# EAGLE design ADS1015_shield (EAGLE 7.2.0)
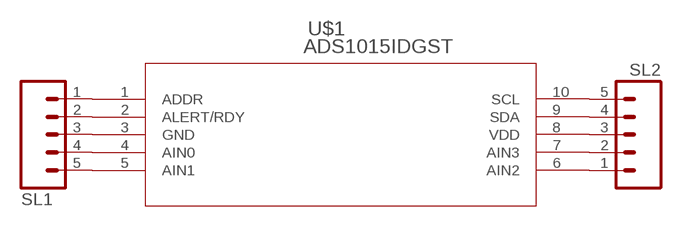
[diagram p0: schematic, sheet 1]

## Parts
SL1  M05  [05P]
SL2  M05  [05P]
U$1  ADS1015IDGST  [DGS10]

## Nets
N$1: SL1.1 U$1.1(ADDR)
N$2: SL1.2 U$1.2(ALERT/RDY)
N$3: SL1.3 U$1.3(GND)
N$4: SL1.4 U$1.4(AIN0)
N$5: SL1.5 U$1.5(AIN1)
N$6: SL2.1 U$1.6(AIN2)
N$7: SL2.2 U$1.7(AIN3)
N$8: SL2.3 U$1.8(VDD)
N$9: SL2.4 U$1.9(SDA)
N$10: SL2.5 U$1.10(SCL)

## Library data of the parts
SL1 SL2 = con-amp-quick:M05: AMP QUICK CONNECTOR; OC_FARNELL: unknown; OC_NEWARK: unknown
U$1 = ADS105IDGST:ADS1015IDGST; COPYRIGHT: Copyright C 2015 Accelerated Designs. All rights reserved; FAMILY: ADC; MANUFACTURER_NAME: Texas Instruments; MANUFACTURER_PART_NUMBER: ADS1015IDGST; RSPARTNUMBER: 7094550; SECTION: Data Converters; VENDOR: Texas Instruments

## Board
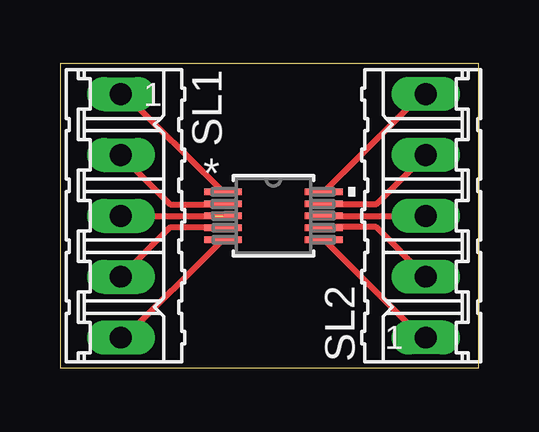
[diagram p1: board, top side]

Size 17.45 x 12.69 mm. Coordinates in mm from the lower left corner, seen from the top.
Outline: 0,0 17.45,0 17.45,12.69 0,12.69 0,0
Copper layers (1*16): Top 0.035mm / dielectric 1.5mm / Bottom 0.035mm
Design rules "default": minimum track width 10mil, minimum drill 24mil, track to track 8mil, track to pad 8mil, pad to pad 8mil, via to via 8mil, smd to smd 8mil, copper to edge 40mil, drill to drill 8mil, minimum pad ring 10mil, minimum via ring 8mil, stop-mask expansion 4mil, vias tented up to drill 0mil, thermal gap 10mil

### Footprints (pad centres in the part's own frame; a part is rotated, then mirrored left to right if it is on the bottom)
05P = drill 0.914 long: 1 -5.08,0; 2 -2.54,0; 3 0,0; 4 2.54,0; 5 5.08,0
DGS10 = smd 1.575 x 0.279: 1 -2.095,1; 2 -2.095,0.5; 3 -2.095,0; 4 -2.095,-0.5; 5 -2.095,-1; 6 2.095,-1; 7 2.095,-0.5; 8 2.095,0; 9 2.095,0.5; 10 2.095,1

### Placement (x,y rotation side)
SL1  2.54,6.35 270 top
SL2  15.24,6.35 90 top
U$1  8.89,6.35 0 top

### Tracks (layer width: path | path; a pad name or v marks a point on that pad's centre or on a via)
N$1
  Top 0.254: SL1.1 2.7,11.43 6.67,7.46 U$1.1
N$2
  Top 0.254: SL1.2 4.6,6.83 6.67,6.83 U$1.2
N$3  (1 unrouted)
  Top 0.254: SL1.3 6.35,6.35
N$4
  Top 0.254: SL1.4 4.6,5.87 6.67,5.87 U$1.4
N$5
  Top 0.254: SL1.5 2.7,1.27 6.67,5.24 U$1.5
N$6
  Top 0.254: SL2.1 15.08,1.27 11.11,5.24 U$1.6
N$7
  Top 0.254: SL2.2 13.18,5.87 11.11,5.87 U$1.7
N$8
  Top 0.254: U$1.8 SL2.3
N$9
  Top 0.254: SL2.4 13.18,6.83 11.11,6.83 U$1.9
N$10
  Top 0.254: SL2.5 15.08,11.43 11.11,7.46 U$1.10